# Altium schematic sheet SCHE.SchDoc
size A3; SheetNumber: 1; SheetTotal: 1
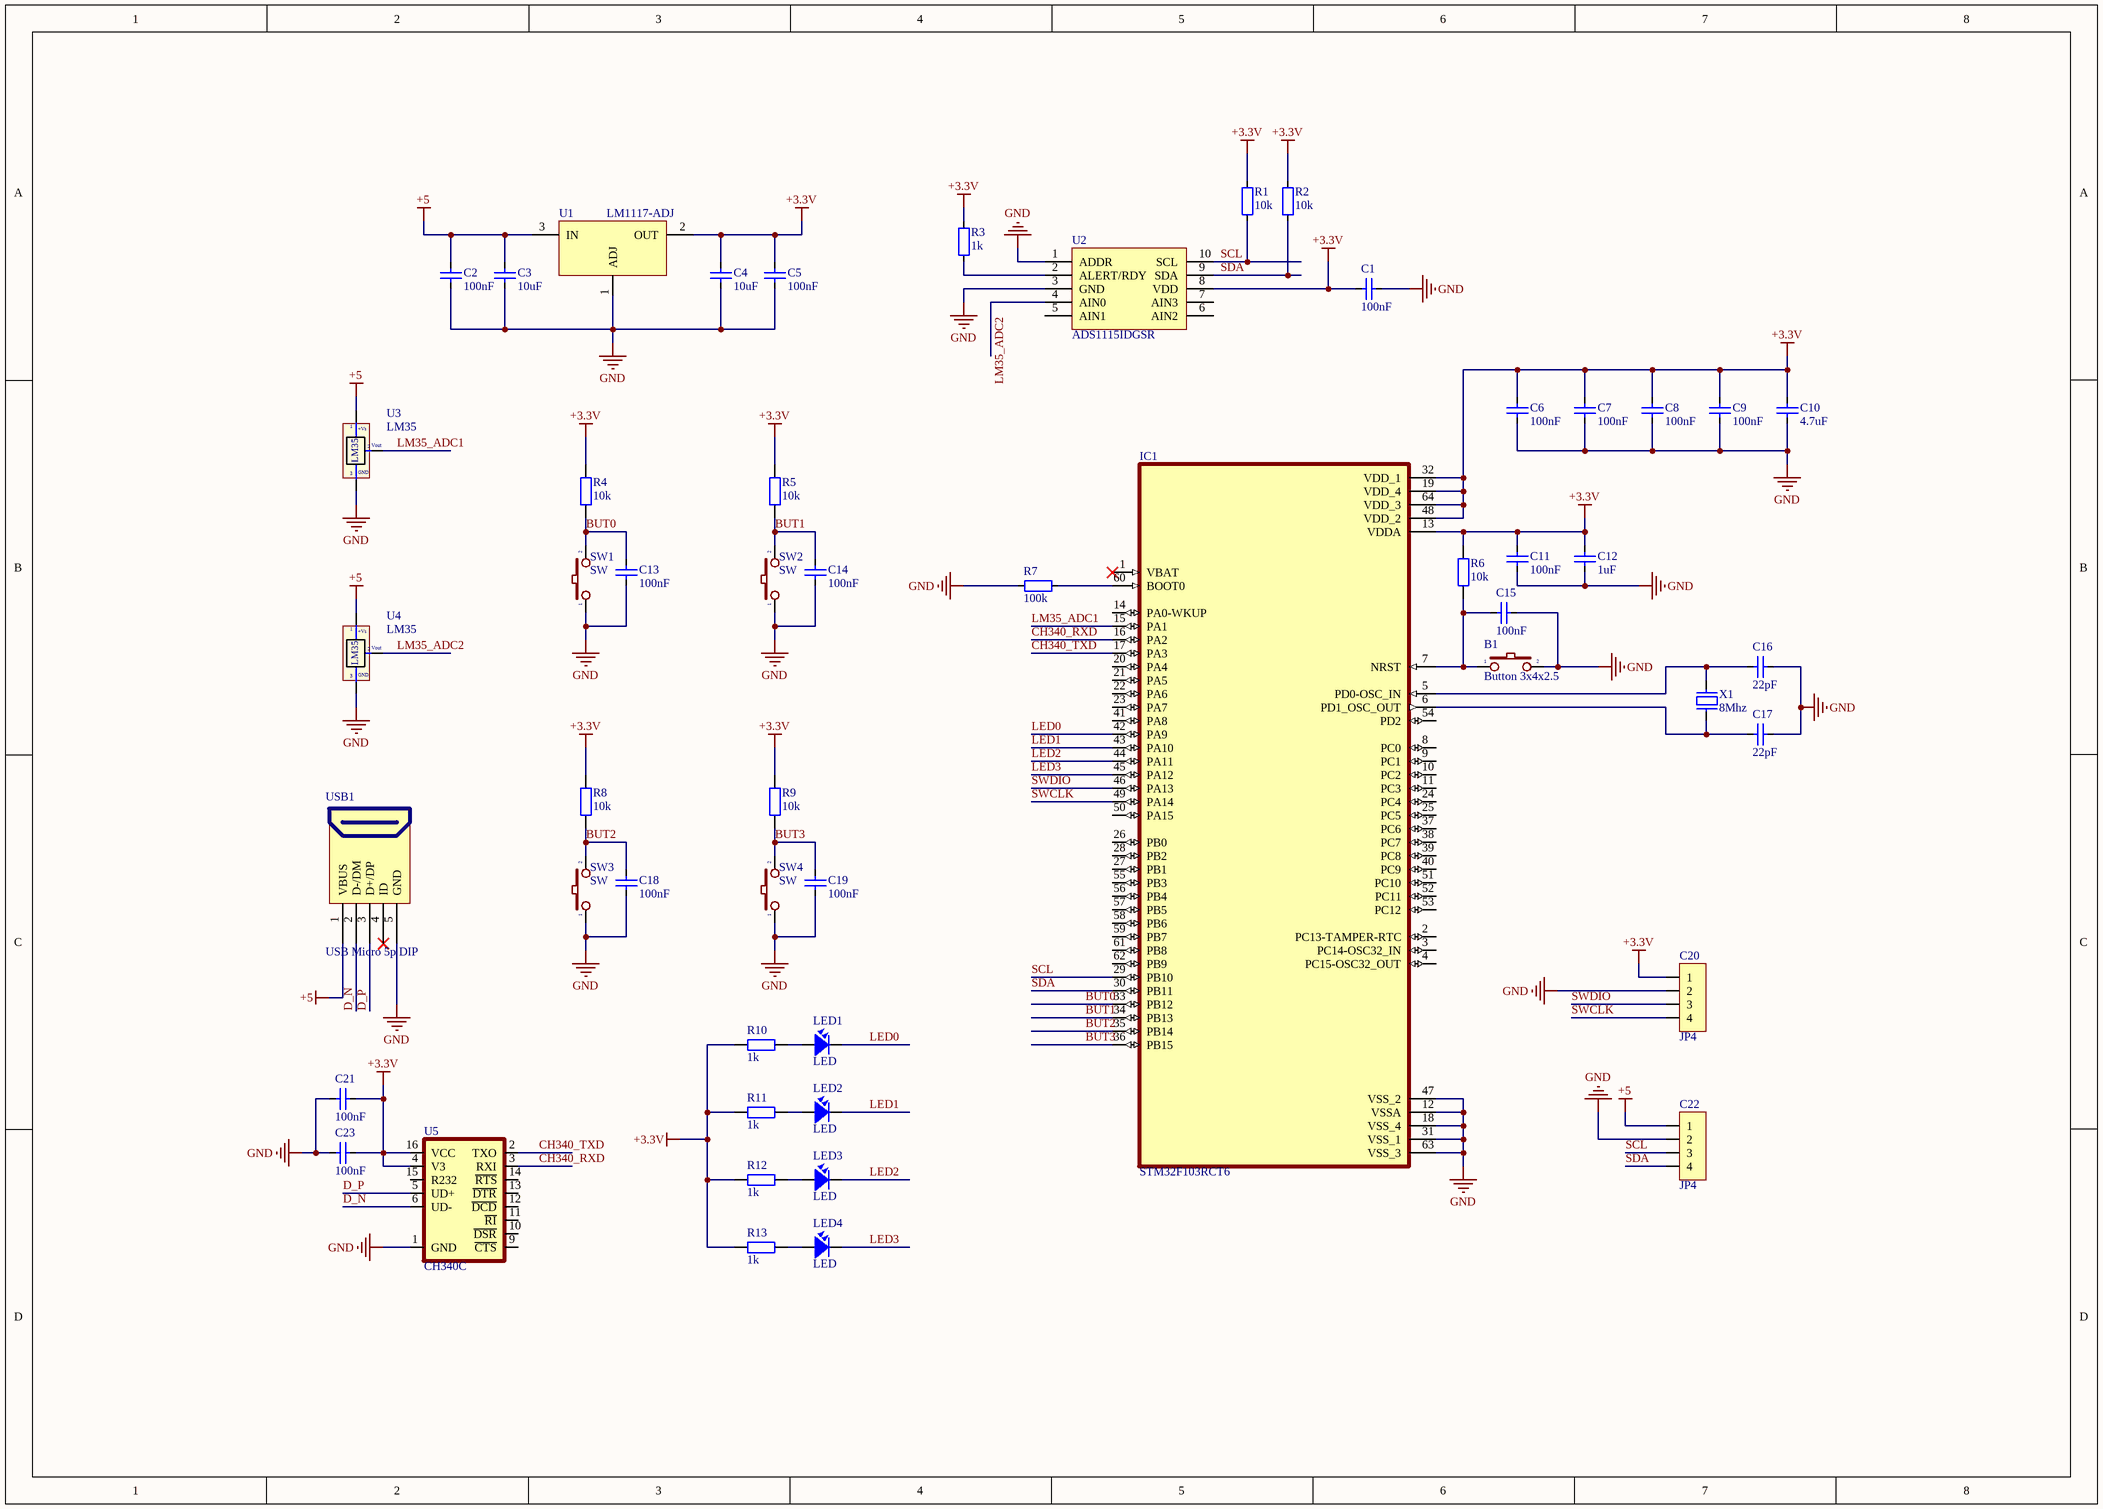
[diagram p0: SCHE.SchDoc]

## Parts
B1  Button 3x4x2.5  [Button 3x4x2.5]
C1  100nF  [CAP_0805]
C2  100nF  [CAP_0805]
C3  10uF  [CAP_0805]
C4  10uF  [CAP_0805]
C5  100nF  [CAP_0805]
C6  100nF  [CAP_0805]
C7  100nF  [CAP_0805]
C8  100nF  [CAP_0805]
C9  100nF  [CAP_0805]
C10  4.7uF  [CAP_0805]
C11  100nF  [CAP_0805]
C12  1uF  [CAP_0805]
C13  100nF  [CAP_0805]
C14  100nF  [CAP_0805]
C15  100nF  [CAP_0805]
C16  22pF  [CAP_0805]
C17  22pF  [CAP_0805]
C18  100nF  [CAP_0805]
C19  100nF  [CAP_0805]
C20  JP4  [JP4-C1T]
C21  100nF  [CAP_0805]
C22  JP4  [JP4-C1T]
C23  100nF  [CAP_0805]
IC1  STM32F103RCT6  [STM32F103RCT6]
LED1  LED  [LED-0805-Blue]
LED2  LED  [LED-0805-Green]
LED3  LED  [LED-0805-Orange]
LED4  LED  [LED-0805-Red]
R1  10k  [RES-SMD-0805]
R2  10k  [RES-SMD-0805]
R3  1k  [RES-SMD-0805]
R4  10k  [RES-SMD-0805]
R5  10k  [RES-SMD-0805]
R6  10k  [RES-SMD-0805]
R7  100k  [RES-SMD-0805]
R8  10k  [RES-SMD-0805]
R9  10k  [RES-SMD-0805]
R10  1k  [RES-SMD-0805]
R11  1k  [RES-SMD-0805]
R12  1k  [RES-SMD-0805]
R13  1k  [RES-SMD-0805]
SW1  SW  [SW2]
SW2  SW  [SW2]
SW3  SW  [SW2]
SW4  SW  [SW2]
U1  LM1117-ADJ  [LM1117-SOP]
U2  ADS1115IDGSR  [VSOP-10_19.6_230_57X12_SMD]
U3  LM35  [QTO-92]
U4  LM35  [QTO-92]
U5  CH340C  [SO016]
USB1  USB Micro 5p DIP  [USB Micro 5p DIP]
X1  8Mhz  [XTAL 5032 SMD]

## Nets
+3.3V: C1.1 C4.1 C5.1 C6.2 C7.2 C8.2 C9.2 C10.2 C11.2 C12.2 C20.1 C21.2 C23.2 IC1.13(VDDA) IC1.19(VDD_4) IC1.32(VDD_1) IC1.48(VDD_2) IC1.64(VDD_3) R1.1 R2.1 R3.1 R4.1 R5.1 R6.2 R8.1 R9.1 R10.1 R11.1 R12.1 R13.1 U1.2(OUT) U2.8(VDD) U5.4(V3) U5.16(VCC)
+5: C2.1 C3.1 C22.1 U1.3(IN) U3.1(+Vs) U4.1(+Vs) USB1.1(VBUS)
GND: B1.2 C1.2 C2.2 C3.2 C4.2 C5.2 C6.1 C7.1 C8.1 C9.1 C10.1 C11.1 C12.1 C13.1 C14.1 C15.1 C16.1 C17.1 C18.1 C19.1 C20.2 C21.1 C22.2 C23.1 IC1.12(VSSA) IC1.18(VSS_4) IC1.31(VSS_1) IC1.47(VSS_2) IC1.63(VSS_3) R7.1 SW1.1 SW2.1 SW3.1 SW4.1 U1.1(ADJ) U2.1(ADDR) U2.3(GND) U3.3(-) U4.3(-) U5.1(GND) USB1.5(GND)
BUT0: C13.2 IC1.33(PB12) R4.2 SW1.2
BUT1: C14.2 IC1.34(PB13) R5.2 SW2.2
BUT2: C18.2 IC1.35(PB14) R8.2 SW3.2
BUT3: C19.2 IC1.36(PB15) R9.2 SW4.2
CH340_RXD: IC1.16(PA2) U5.3(RXI)
CH340_TXD: IC1.17(PA3) U5.2(TXO)
D_N: U5.6(UD-) USB1.2(D-/DM)
D_P: U5.5(UD+) USB1.3(D+/DP)
LED0: IC1.42(PA9) LED1.2
LED1: IC1.43(PA10) LED2.2
LED2: IC1.44(PA11) LED3.2
LED3: IC1.45(PA12) LED4.2
LM35_ADC1: IC1.15(PA1) U3.2(Vout)
LM35_ADC2: U2.4(AIN0) U4.2(Vout)
SCL: C22.3 IC1.29(PB10) R1.2 U2.10(SCL)
SDA: C22.4 IC1.30(PB11) R2.2 U2.9(SDA)
SWCLK: C20.4 IC1.49(PA14)
SWDIO: C20.3 IC1.46(PA13)
NetB1_1: B1.1 C15.2 IC1.7(NRST) R6.1
NetC16_2: C16.2 IC1.5(PD0-OSC_IN) X1.2
NetC17_2: C17.2 IC1.6(PD1_OSC_OUT) X1.1
NetIC1_60: IC1.60(BOOT0) R7.2
NetLED1_1: LED1.1 R10.2
NetLED2_1: LED2.1 R11.2
NetLED3_1: LED3.1 R12.2
NetLED4_1: LED4.1 R13.2
NetR3_2: R3.2 U2.2(ALERT/RDY)

Not connected (* = marked no-connect by the designer): IC1 1(VBAT)* 2(PC13-TAMPER-RTC) 3(PC14-OSC32_IN) 4(PC15-OSC32_OUT) 8(PC0) 9(PC1) 10(PC2) 11(PC3) 14(PA0-WKUP) 20(PA4) 21(PA5) 22(PA6) 23(PA7) 24(PC4) 25(PC5) 26(PB0) 27(PB1) 28(PB2) 37(PC6) 38(PC7) 39(PC8) 40(PC9) 41(PA8) 50(PA15) 51(PC10) 52(PC11) 53(PC12) 54(PD2) 55(PB3) 56(PB4) 57(PB5) 58(PB6) 59(PB7) 61(PB8) 62(PB9); U2 5(AIN1) 6(AIN2) 7(AIN3); U5 9(~{CTS}) 10(~{DSR}) 11(~{RI}) 12(~{DCD}) 13(~{DTR}) 14(~{RTS}) 15(R232); USB1 4(ID)*

## Notes on the sheet
- (in symbol LM35) GND

## Library data of the parts
C1-C19 C21 C23 = CapSMD: Capacitor; Value: 33p; Published: 8-Jun-2000; LatestRevisionDate: 17-Jul-2002; LatestRevisionNote: Re-released for DXP Platform.; PackageReference: RAD-0.3; Publisher: Altium Limited
C20 C22 = JP4: WR-PHD 2.54 mm Angled Socket Header; Manufacturer: W¨¹rth Elektronik eiSos GmbH; partNo: 613004143121; ComponentLink1 Description: Manufacturer; ComponentLink2 Description: Datasheet; NoPins: 04; Created Date: 29 March 2013; ComponentLink1URL: http://www.we-online.com; ComponentLink2URL: http://katalog.we-online.de/em/datasheet/6130xx143121.pdf; Created by: Karrer Zheng
LED1-LED4 = LED: LED Single colour Green and Red; Value: LED 3 ly Single Colour
R1-R3 R7 = Resistor - SMD: Resistor; Manufacturer: Generic Components; Class: Passive; Published: 08/06/2000; Publisher: Altium Hobart Technology Centre
R4-R6 R8-R13 = Resistor - SMD: Resistor SMD; Manufacturer: Generic Components; Class: Passive; Published: 08/06/2000; Publisher: Altium Hobart Technology Centre
SW1-SW4 = SW2: Switch button 2 pin; Value: SW chip 2 pin
U1 = LM1117-ADJ: 800mA Low-Dropout Linear Regulator; Creator: Nguyen Ba Bien; Website: http://group3i.net
U2 = IC_ADS1115IDGSR: Analog to Digital Converters - ADC 16B ADC w/ Int MUX PGA Comp Osc & Ref; Manufacturer: Texas Instruments; Alternate Part Number-1: NA; Manufacturer Part Number: ADS1115IDGSR; Case/Package: MSOP-10; Supplier-1: Mouser; Supplier Part Number-1: 595-ADS1115IDGSR
U3 U4 = LM35: Teminal; Value: LM35
U5 = CH340C: USB to serial chip CH340; MF: WCH; Package: Package; Check_prices: https://www.snapeda.com/parts/CH340C/WCH/view-part/5428851/?ref=eda; Value: *; Price: None; MP: CH340C; Availability: Unavailable; SnapEDA_Link: https://www.snapeda.com/parts/CH340C/WCH/view-part/5428851/?ref=snap
USB1 = USB Micro 5p DIP: USB Type B; Ten: MicroUSB MK5P DIP; Ma_Hang: MH005145
X1 = XT2: Crystal For all Crystal 2pin.; Value: 4Mhz